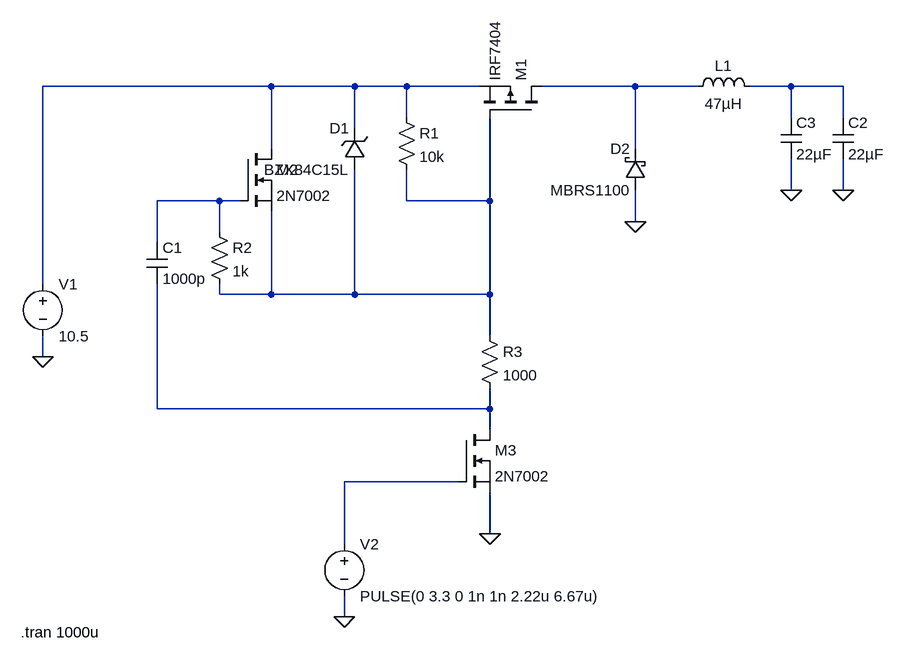
[diagram p0: schematic Gate Drive Circuit.asc]
Gate Drive Circuit.asc, the LTspice schematic file:
Version 4
SHEET 1 1332 680
WIRE 384 -192 32 -192
WIRE 512 -192 384 -192
WIRE 592 -192 512 -192
WIRE 704 -192 592 -192
WIRE 944 -192 800 -192
WIRE 1040 -192 944 -192
WIRE 1184 -192 1120 -192
WIRE 1264 -192 1184 -192
WIRE 592 -144 592 -192
WIRE 1184 -144 1184 -192
WIRE 1264 -144 1264 -192
WIRE 512 -128 512 -192
WIRE 384 -96 384 -192
WIRE 944 -96 944 -192
WIRE 1184 -32 1184 -80
WIRE 1264 -32 1264 -80
WIRE 304 -16 208 -16
WIRE 336 -16 304 -16
WIRE 592 -16 592 -64
WIRE 720 -16 720 -144
WIRE 720 -16 592 -16
WIRE 944 16 944 -32
WIRE 304 32 304 -16
WIRE 208 48 208 -16
WIRE 32 112 32 -192
WIRE 304 128 304 112
WIRE 384 128 384 0
WIRE 384 128 304 128
WIRE 512 128 512 -64
WIRE 512 128 384 128
WIRE 720 128 720 -16
WIRE 720 128 512 128
WIRE 720 192 720 128
WIRE 32 224 32 192
WIRE 208 304 208 112
WIRE 720 304 720 272
WIRE 720 304 208 304
WIRE 720 336 720 304
WIRE 672 416 496 416
WIRE 720 496 720 432
WIRE 496 512 496 416
WIRE 496 624 496 592
FLAG 944 16 0
FLAG 1264 -32 0
FLAG 720 496 0
FLAG 496 624 0
FLAG 32 224 0
FLAG 1184 -32 0
SYMBOL voltage 32 96 R0
WINDOW 123 0 0 Left 0
WINDOW 39 0 0 Left 0
SYMATTR InstName V1
SYMATTR Value 10.5
SYMBOL pmos 800 -144 M270
SYMATTR InstName M1
SYMATTR Value IRF7404
SYMBOL res 576 -160 R0
SYMATTR InstName R1
SYMATTR Value 10k
SYMBOL zener 528 -64 R180
WINDOW 0 24 64 Left 2
WINDOW 3 24 0 Left 2
SYMATTR InstName D1
SYMATTR Value BZX84C15L
SYMATTR Description Diode
SYMATTR Type diode
SYMBOL nmos 336 -96 R0
SYMATTR InstName M2
SYMATTR Value 2N7002
SYMBOL nmos 672 336 R0
SYMATTR InstName M3
SYMATTR Value 2N7002
SYMBOL res 288 16 R0
SYMATTR InstName R2
SYMATTR Value 1k
SYMBOL cap 192 48 R0
SYMATTR InstName C1
SYMATTR Value 1000p
SYMBOL res 704 176 R0
SYMATTR InstName R3
SYMATTR Value 1000
SYMBOL voltage 496 496 R0
WINDOW 123 0 0 Left 0
WINDOW 39 0 0 Left 0
SYMATTR InstName V2
SYMATTR Value PULSE(0 3.3 0 1n 1n 2.22u 6.67u)
SYMBOL schottky 960 -32 R180
WINDOW 0 24 64 Left 2
WINDOW 3 24 0 Left 2
SYMATTR InstName D2
SYMATTR Value MBRS1100
SYMATTR Description Diode
SYMATTR Type diode
SYMBOL ind 1024 -176 R270
WINDOW 0 32 56 VTop 2
WINDOW 3 5 56 VBottom 2
SYMATTR InstName L1
SYMATTR Value 47µH
SYMBOL cap 1248 -144 R0
SYMATTR InstName C2
SYMATTR Value 22µF
SYMBOL cap 1168 -144 R0
SYMATTR InstName C3
SYMATTR Value 22µF
TEXT -2 648 Left 2 !.tran 1000u

The netlist it stands for:
* Gate Drive Circuit.asc
V1 N001 0 10.5
M1 N002 N005 N001 N001 IRF7404
R1 N001 N005 10k
D1 N005 N001 BZX84C15L
M2 N001 N004 N005 N005 2N7002
M3 N006 N007 0 0 2N7002
R2 N004 N005 1k
C1 N004 N006 1000p
R3 N005 N006 1000
V2 N007 0 PULSE(0 3.3 0 1n 1n 2.22u 6.67u)
D2 0 N002 MBRS1100
L1 N002 N003 47µH
C2 N003 0 22µF
C3 N003 0 22µF
.model D D
.lib standard.dio
.model NMOS NMOS
.model PMOS PMOS
.lib standard.mos
.tran 1000u
.backanno
.end